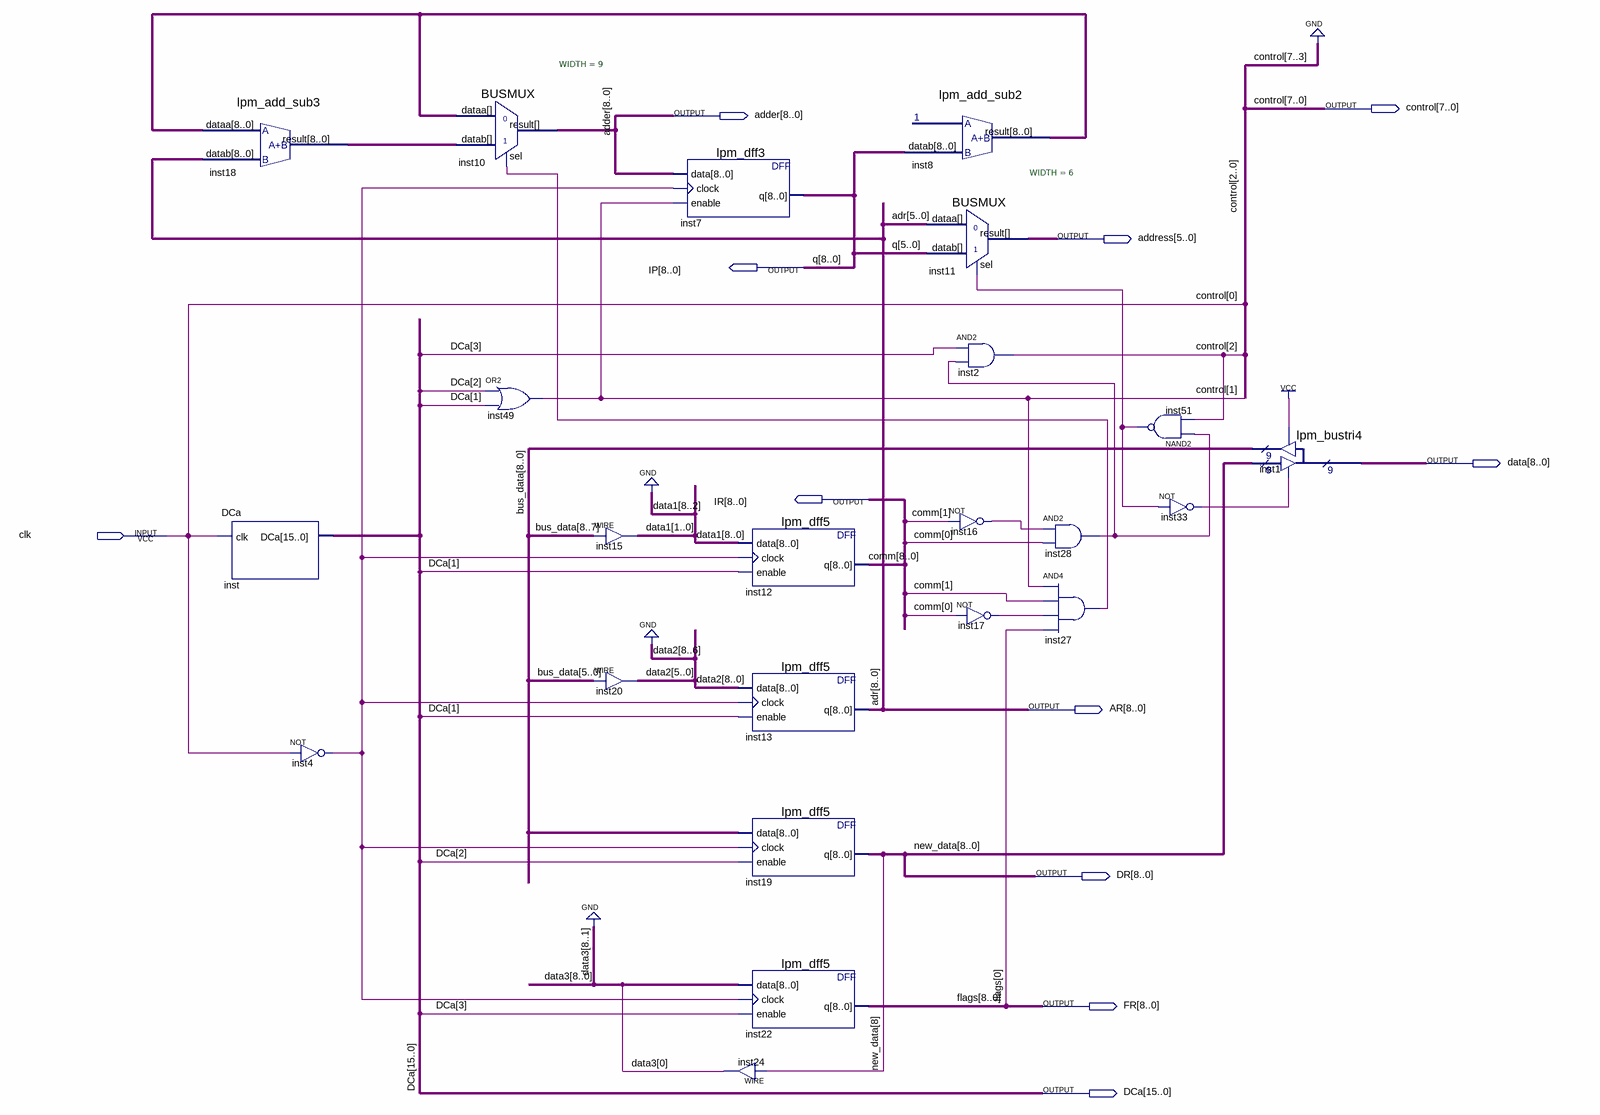
[diagram p0: schematic sheet]
// Quartus schematic cu.bdf as structural Verilog: 23 symbols, 11 pins
module cu (
  input  clk,
  output [7:0] control,
  output [8:0] adder,
  output [5:0] address,
  output [8:0] IP,
  output [8:0] data,
  output [8:0] IR,
  output [8:0] AR,
  output [8:0] DR,
  output [8:0] FR,
  output [15:0] DCa
);

  wire inst4_out, inst16_out, inst17_out, inst27_out, inst28_out, inst33_out, inst51_out;
  wire [0:0] data3;
  wire [1:0] data1;
  wire [5:0] data2;
  wire [8:0] bus_data, inst8_result, inst18_result;

  lpm_add_sub3 inst18 (.dataa(inst8_result), .datab(AR), .result(inst18_result));
  DCa inst (.clk(clk), .DCa(DCa));
  not inst4 (inst4_out, clk);
  BUSMUX #(.WIDTH(9)) inst10 (.datab(inst18_result), .sel(inst27_out), .dataa(inst8_result), .result(adder));
  or inst49 (control[1], DCa[2], DCa[1]);
  assign data1 = bus_data[8:7];  // WIRE inst15
  assign data2 = bus_data[5:0];  // WIRE inst20
  lpm_dff3 inst7 (.data(adder), .clock(inst4_out), .enable(control[1]), .q(IP));
  lpm_dff5 inst12 (.data({{7{1'b0}}, data1}), .clock(inst4_out), .enable(DCa[1]), .q(IR));
  lpm_dff5 inst13 (.data({3'b000, data2}), .clock(inst4_out), .enable(DCa[1]), .q(AR));
  lpm_dff5 inst19 (.data(bus_data), .clock(inst4_out), .enable(DCa[2]), .q(DR));
  lpm_dff5 inst22 (.data({{8{1'b0}}, data3[0]}), .clock(inst4_out), .enable(DCa[3]), .q(FR));
  assign data3[0] = DR[8];  // WIRE inst24
  lpm_add_sub2 inst8 (.datab(IP), .result(inst8_result));
  BUSMUX #(.WIDTH(6)) inst11 (.datab(IP[5:0]), .sel(inst51_out), .dataa(AR[5:0]), .result(address));
  and inst2 (control[2], DCa[3], inst28_out);
  not inst16 (inst16_out, IR[1]);
  not inst17 (inst17_out, IR[0]);
  and inst28 (inst28_out, inst16_out, IR[0]);
  and inst27 (inst27_out, control[1], IR[1], inst17_out, FR[0]);
  nand inst51 (inst51_out, inst28_out, control[2]);
  not inst33 (inst33_out, inst51_out);
  lpm_bustri4 inst1 (.enabledt(inst33_out), .data(DR), .enabletr(1'b1), .result(bus_data), .tridata(data));

  assign {control[7:3], control[0]} = {{5{1'b0}}, clk};

  // Other names for the same wires on the sheet: adr[8:0] = AR; comm[8:0] = IR; new_data[8:0] = DR; flags[8:0] = FR;
  //   q[8:0] = IP
endmodule
